# Altium schematic sheet Actuators.SchDoc
size A; SheetNumber: 4
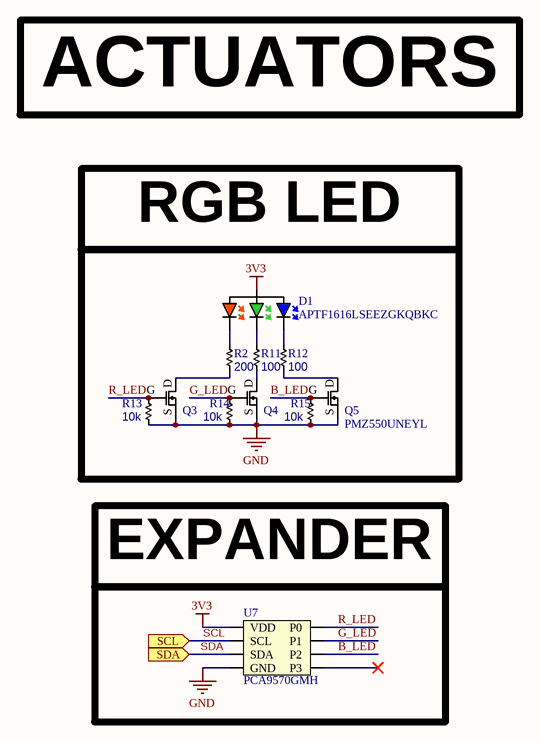
[diagram p0: Actuators.SchDoc]

## Parts
D1  APTF1616LSEEZGKQBKC  [APTF1616LSEEZGKQBKC]
Q3  PMZ550UNEYL  [PMZ550UNEYL]  (value not drawn)
Q4  PMZ550UNEYL  [PMZ550UNEYL]  (value not drawn)
Q5  PMZ550UNEYL  [PMZ550UNEYL]
R2  200  [RES_0402_HIGH]
R11  100  [RES_0402_HIGH]
R12  100  [RES_0402_HIGH]
R13  10k  [RES_0402_HIGH]
R14  10k  [RES_0402_HIGH]
R15  10k  [RES_0402_HIGH]
U7  PCA9570GMH  [PCA9570GMH]

## Ports
SCL, SDA

## Nets
3V3: D1.1 U7.8(VDD)
GND: Q3.S Q4.S Q5.S R13.1 R14.1 R15.1 U7.4(GND)
B_LED: Q5.G R15.2 U7.3(P2)
G_LED: Q4.G R14.2 U7.2(P1)
R_LED: Q3.G R13.2 U7.1(P0)
SCL: U7.6(SCL) ; port SCL
SDA: U7.7(SDA) ; port SDA
NetD1_2: D1.2 R2.2
NetD1_3: D1.3 R11.2
NetD1_4: D1.4 R12.2
NetQ3_D: Q3.D R2.1
NetQ4_D: Q4.D R11.1
NetQ5_D: Q5.D R12.1

Not connected (* = marked no-connect by the designer): U7 5(P3)*

## Notes on the sheet
- ACTUATORS
- RGB LED
- (near U7) EXPANDER

## Library data of the parts
D1 = APTF1616LSEEZGKQBKC: APTF1616LSEEZGKQBKC Red, Green, Blue (RGB) 621nm Red, 525nm Green, 465nm Blue LED Indication - Discrete 1.8V Red, 2.7V Green, 2.7V Blue 0606 (1616 Metric)
Q3-Q5 = PMZ550UNEYL: PMZ550UNEYL N-Channel 30V 590mA (Ta) 310mW (Ta), 1.67W (Tc) Surface Mount DFN1006-3
R2 R11-R15 = Resistor_0402: 0402 Resistor
U7 = PCA9570GMH: PCA9570GMH I/O Expander 4 I²C, SMBus 100kHz 8-XQFN (1.6x1.6)